# Altium schematic sheet remote_control_light.SchDoc
size A4
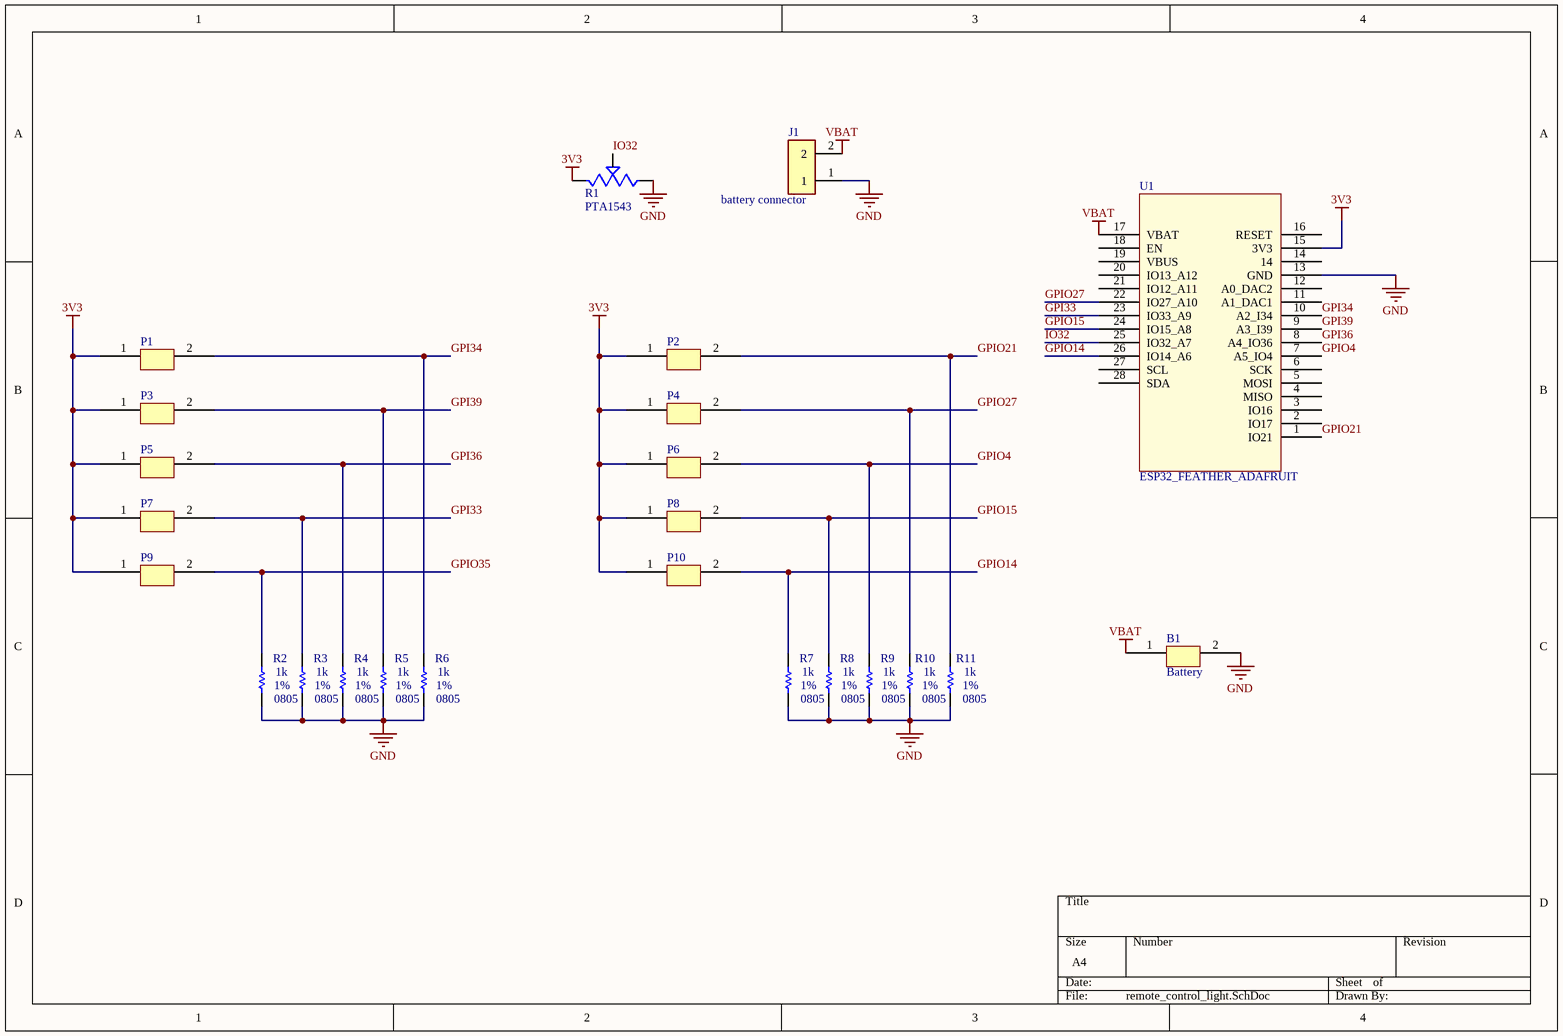
[diagram p0: remote_control_light.SchDoc]

## Parts
B1  Battery  [battery-3.7V-1200mAh]
J1  battery connector  [Battery connector]
P1  PUSH_BUTTON_D6F  [PUSH_BUTTON_D6F]  (value not drawn)
P2  PUSH_BUTTON_D6F  [PUSH_BUTTON_D6F]  (value not drawn)
P3  PUSH_BUTTON_D6F  [PUSH_BUTTON_D6F]  (value not drawn)
P4  PUSH_BUTTON_D6F  [PUSH_BUTTON_D6F]  (value not drawn)
P5  PUSH_BUTTON_D6F  [PUSH_BUTTON_D6F]  (value not drawn)
P6  PUSH_BUTTON_D6F  [PUSH_BUTTON_D6F]  (value not drawn)
P7  PUSH_BUTTON_D6F  [PUSH_BUTTON_D6F]  (value not drawn)
P8  PUSH_BUTTON_D6F  [PUSH_BUTTON_D6F]  (value not drawn)
P9  PUSH_BUTTON_D6F  [PUSH_BUTTON_D6F]  (value not drawn)
P10  PUSH_BUTTON_D6F  [PUSH_BUTTON_D6F]  (value not drawn)
R1  PTA1543  [POT PTA1543]
R2  value 1k  Package: 0805  Precision: 1%  [RES_0805]  (hidden comment: RES - 0805)
R3  value 1k  Package: 0805  Precision: 1%  [RES_0805]  (hidden comment: RES - 0805)
R4  value 1k  Package: 0805  Precision: 1%  [RES_0805]  (hidden comment: RES - 0805)
R5  value 1k  Package: 0805  Precision: 1%  [RES_0805]  (hidden comment: RES - 0805)
R6  value 1k  Package: 0805  Precision: 1%  [RES_0805]  (hidden comment: RES - 0805)
R7  value 1k  Package: 0805  Precision: 1%  [RES_0805]  (hidden comment: RES - 0805)
R8  value 1k  Package: 0805  Precision: 1%  [RES_0805]  (hidden comment: RES - 0805)
R9  value 1k  Package: 0805  Precision: 1%  [RES_0805]  (hidden comment: RES - 0805)
R10  value 1k  Package: 0805  Precision: 1%  [RES_0805]  (hidden comment: RES - 0805)
R11  value 1k  Package: 0805  Precision: 1%  [RES_0805]  (hidden comment: RES - 0805)
U1  ESP32_FEATHER_ADAFRUIT  [ESP32_FEATHER]

## Nets
3V3: P1.1 P2.1 P3.1 P4.1 P5.1 P6.1 P7.1 P8.1 P9.1 P10.1 R1.3(CW) U1.15(3V3)
GND: B1.2 J1.1 R1.1(CCW) R2.1 R3.1 R4.1 R5.1 R6.1 R7.1 R8.1 R9.1 R10.1 R11.1 U1.13(GND)
VBAT: B1.1 J1.2 U1.17(VBAT)
GPI33: P7.2 R3.2 U1.23(IO33_A9)
GPI34: P1.2 R6.2 U1.10(A2_I34)
GPI36: P5.2 R4.2 U1.8(A4_IO36)
GPI39: P3.2 R5.2 U1.9(A3_I39)
GPIO4: P6.2 R9.2 U1.7(A5_IO4)
GPIO14: P10.2 R7.2 U1.26(IO14_A6)
GPIO15: P8.2 R8.2 U1.24(IO15_A8)
GPIO21: P2.2 R11.2 U1.1(IO21)
GPIO27: P4.2 R10.2 U1.22(IO27_A10)
GPIO35: P9.2 R2.2
IO32: R1.2(WIPER) U1.25(IO32_A7)

Not connected (* = marked no-connect by the designer): U1 2(IO17) 3(IO16) 4(MISO) 5(MOSI) 6(SCK) 11(A1_DAC1) 12(A0_DAC2) 14 16(RESET) 18(EN) 19(VBUS) 20(IO13_A12) 21(IO12_A11) 27(SCL) 28(SDA)

## Library data of the parts
J1 = CONN_BATT: surface mount battery connector; MP: 1935161; MF: Phoenix Contact; Value: Term bloc 2pos; SnapEDA_Link: https://www.snapeda.com/parts/1935161/Phoenix%20Contact/view-part/423515/?ref=snap; Digi-Key_Purchase_URL: https://www.digikey.ca/product-detail/en/phoenix-contact/1935161/277-1667-ND/568614?utm_source=snapeda&utm_medium=aggregator&utm_campaign=symbol; Digi-Key_Part_Number: 277-1667-ND; Package: None; HelpURL: https://media.digikey.com/pdf/Data%20Sheets/Phoenix%20Contact%20PDFs/1935161.pdf; Supplier Part Number: 277-1667-ND; Mfg Part Number: 1935161
R1 = POT PTA1543: 10 kOhms 0.05W, 1/20W Through Hole Slide Potentiometer Top Adjustment Type; Value: POT 10k; MF: Bourns; MP: 3310P-025-103L; Digi-Key_Part_Number: 3310P-025-103L-ND; Digi-Key_Purchase_URL: https://www.digikey.com/product-detail/en/bourns-inc/3310P-025-103L/3310P-025-103L-ND/2537831?utm_source=snapeda&utm_medium=aggregator&utm_campaign=symbol; Package: None; SnapEDA_Link: https://www.snapeda.com/parts/3310P-025-103L/Bourns/view-part/587282/?ref=snap; HelpURL: https://www.bourns.com/docs/Product-Datasheets/3310.pdf; Supplier Part Number: 3310P-025-103L-ND; Mfg Part Number: 3310P-025-103L
R2-R11 = RES - 0805: Current: *; CreatedBy: Jonathan Bouchard